# EAGLE design psu (EAGLE 6.3)
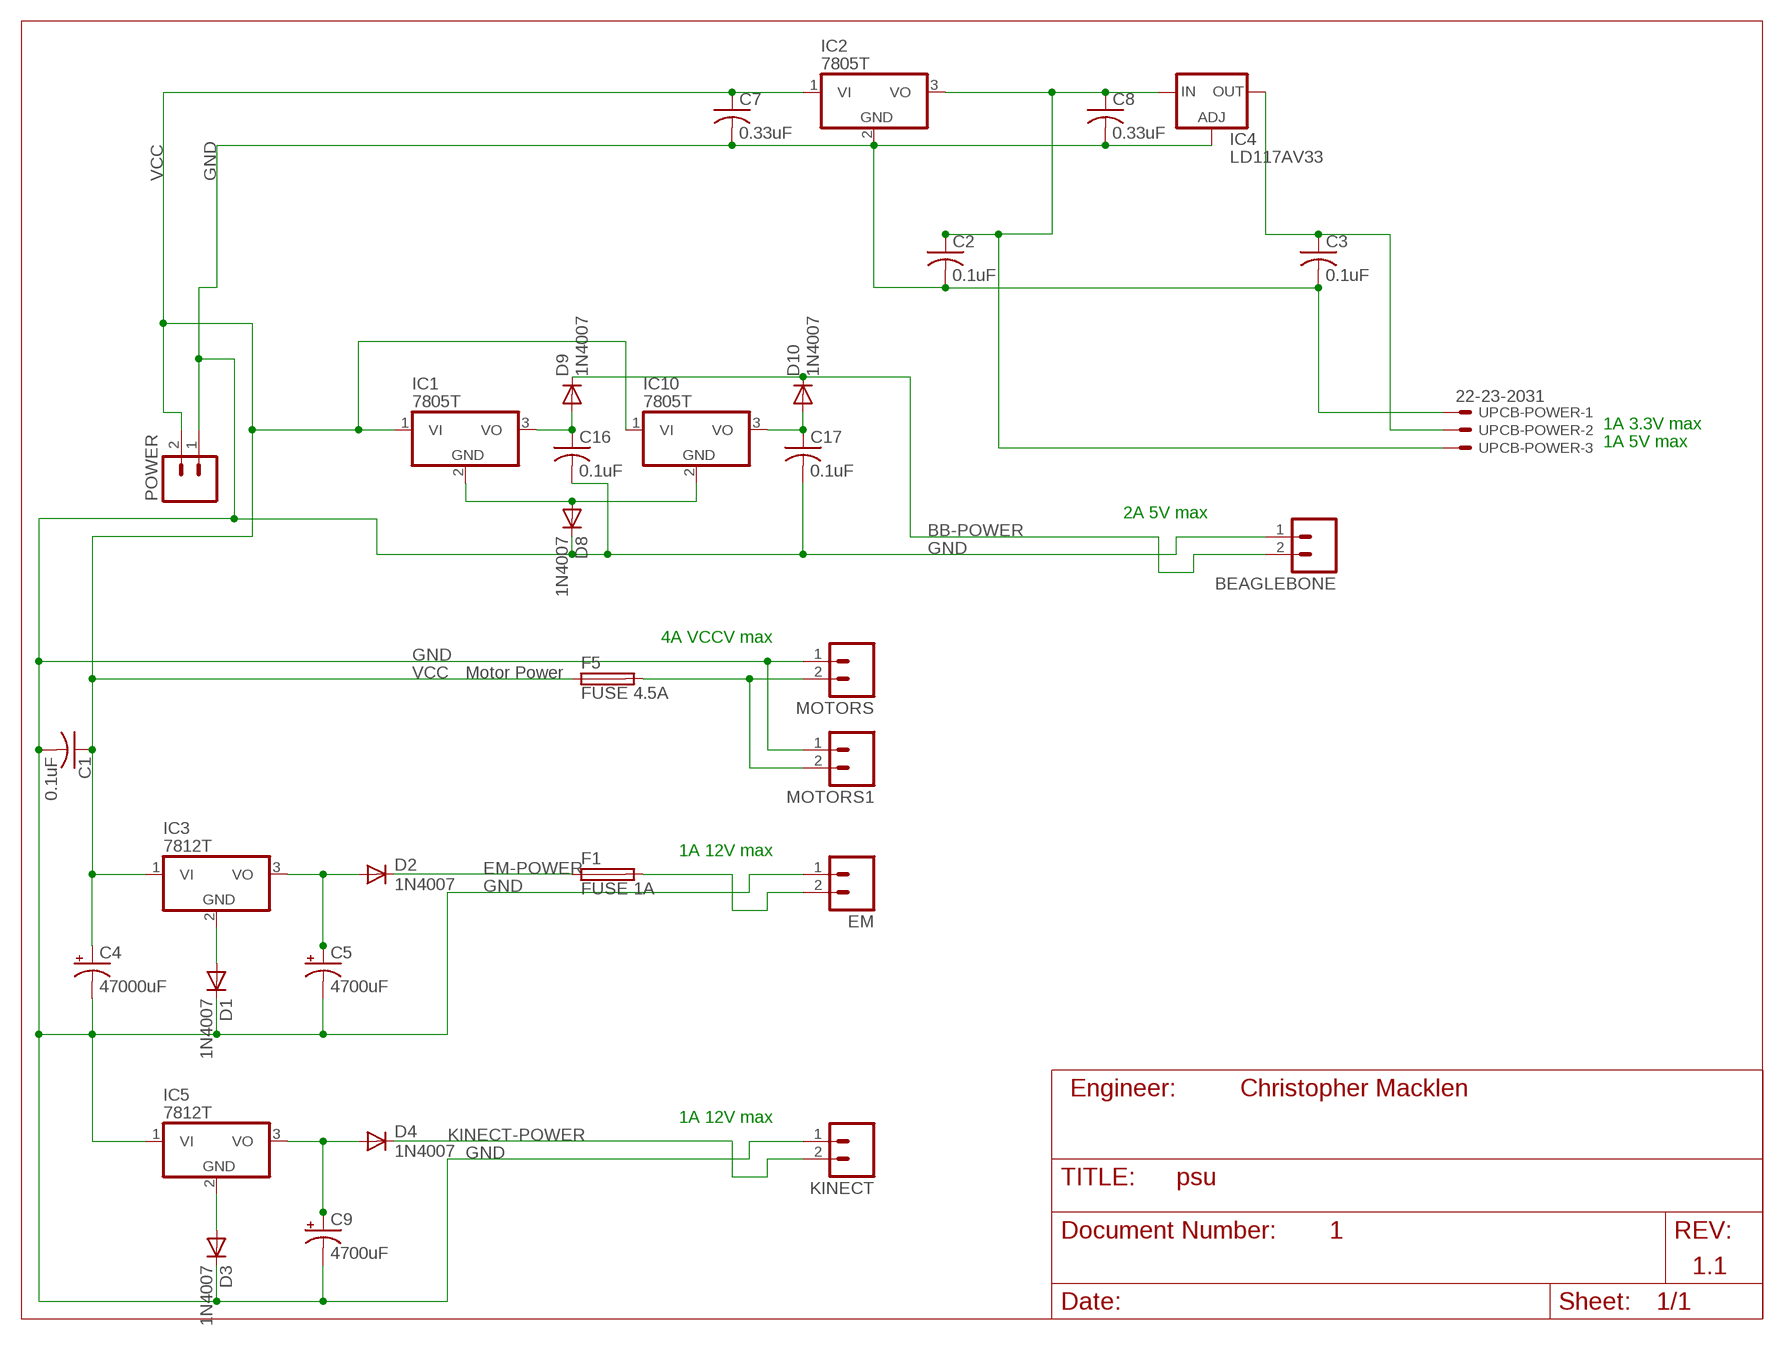
[diagram p0: schematic, sheet 1]

## Parts
BEAGLEBONE  M02  [02P]
C1  0.1uF  C-US025-025X050  [C025-025X050]
C2  0.1uF  C-US025-025X050  [C025-025X050]
C3  0.1uF  C-US025-025X050  [C025-025X050]
C4  47000uF  CPOL-USE2,5-6E  [E2,5-6E]
C5  4700uF  CPOL-USE2,5-6E  [E2,5-6E]
C7  0.33uF  C-US025-025X050  [C025-025X050]
C8  0.33uF  C-US025-025X050  [C025-025X050]
C9  4700uF  CPOL-USE2,5-6E  [E2,5-6E]
C16  0.1uF  C-US025-025X050  [C025-025X050]
C17  0.1uF  C-US025-025X050  [C025-025X050]
D1  1N4007  1N4004  [DO41-10]
D2  1N4007  1N4004  [DO41-10]
D3  1N4007  1N4004  [DO41-10]
D4  1N4007  1N4004  [DO41-10]
D8  1N4007  1N4004  [DO41-10]
D9  1N4007  1N4004  [DO41-10]
D10  1N4007  1N4004  [DO41-10]
EM  M02  [02P]
F1  FUSE 1A  FUSEPICOFUSE  [PICOFUSE]
F5  FUSE 4.5A  FUSEPICOFUSE  [PICOFUSE]
IC1  7805T  [TO220H]
IC2  7805T  [TO220H]
IC3  7812T  [TO220H]
IC4  LD117AV33  [TO220L1]
IC5  7812T  [TO220H]
IC10  7805T  [TO220H]
KINECT  M02  [02P]
MOTORS  M02  [02P]
MOTORS1  M02  [02P]
POWER  M02  [02P]
UPCB-POWER  22-23-2031  [22-23-2031]

## Nets
3.3V: C3.1 IC4.2(OUT) UPCB-POWER.2
5-1A,1: C16.1 D9.A IC1.3(VO)
5V: C2.1 C8.1 IC2.3(VO) IC4.3(IN) UPCB-POWER.3
5V-1A,2: C17.1 D10.A IC10.3(VO)
12V: C5.+ D2.A IC3.3(VO)
12V1: C9.+ D4.A IC5.3(VO)
BB-POWER: BEAGLEBONE.2 D9.C D10.C
EM-POWER: D2.C F1.1
GND: BEAGLEBONE.1 C1.2 C2.2 C3.2 C4.- C5.- C7.2 C8.2 C9.- C16.2 C17.2 D1.C D3.C D8.C EM.1 IC2.2(GND) IC4.1(ADJ) KINECT.1 MOTORS1.1 MOTORS.1 POWER.1 UPCB-POWER.1
GND-IC1: D3.A IC5.2(GND)
GND-IC1,10: D8.A IC1.2(GND) IC10.2(GND)
GND-IC3: D1.A IC3.2(GND)
KINECT-POWER: D4.C KINECT.2
N$2: F5.2 MOTORS1.2 MOTORS.2
N$3: EM.2 F1.2
VCC: C1.1 C4.+ C7.1 F5.1 IC1.1(VI) IC2.1(VI) IC3.1(VI) IC10.1(VI) POWER.2
VCC1: IC5.1(VI)

## Notes on the sheet
- 1A 3.3V max
- 1A 5V max
- 2A 5V max
- 4A VCCV max
- Motor Power
- 1A 12V max
- Engineer: | Christopher Macklen
- 1A 12V max
- 1
- 1.1

## Library data of the parts
BEAGLEBONE EM KINECT MOTORS MOTORS1 POWER = con-amp-quick:M02: AMP QUICK CONNECTOR; OC_FARNELL: unknown; OC_NEWARK: unknown
C1-C3 C7 C8 C16 C17 = rcl:C-US: CAPACITOR, American symbol
C4 C5 C9 = rcl:CPOL-US: POLARIZED CAPACITOR, American symbol
D1-D4 D8-D10 = diode:1N4004: DIODE general purpose rectifier, 1 A
F1 F5 = fuse:FUSE: Fuse; OC_FARNELL: unknown; OC_NEWARK: unknown
IC1-IC3 IC5 IC10 = linear:78*: Positive VOLTAGE REGULATOR Source: http://cache.national.com/ds/LM/LM78L05.pdf http://www.fairchildsemi.com/ds/LM/LM7805.pdf
IC4 = v-reg:LD117A?*: Low drop fixed and adjustable positive voltage regulators 1 A Source: http://www.st.com/stonline/products/literature/ds/7194/ld1117axx.pdf
UPCB-POWER = con-molex:22-23-2031: .100" (2.54mm) Center Header - 3 Pin; MF: MOLEX; MPN: 22-23-2031; OC_FARNELL: 1462950; OC_NEWARK: 30C0862

## Board
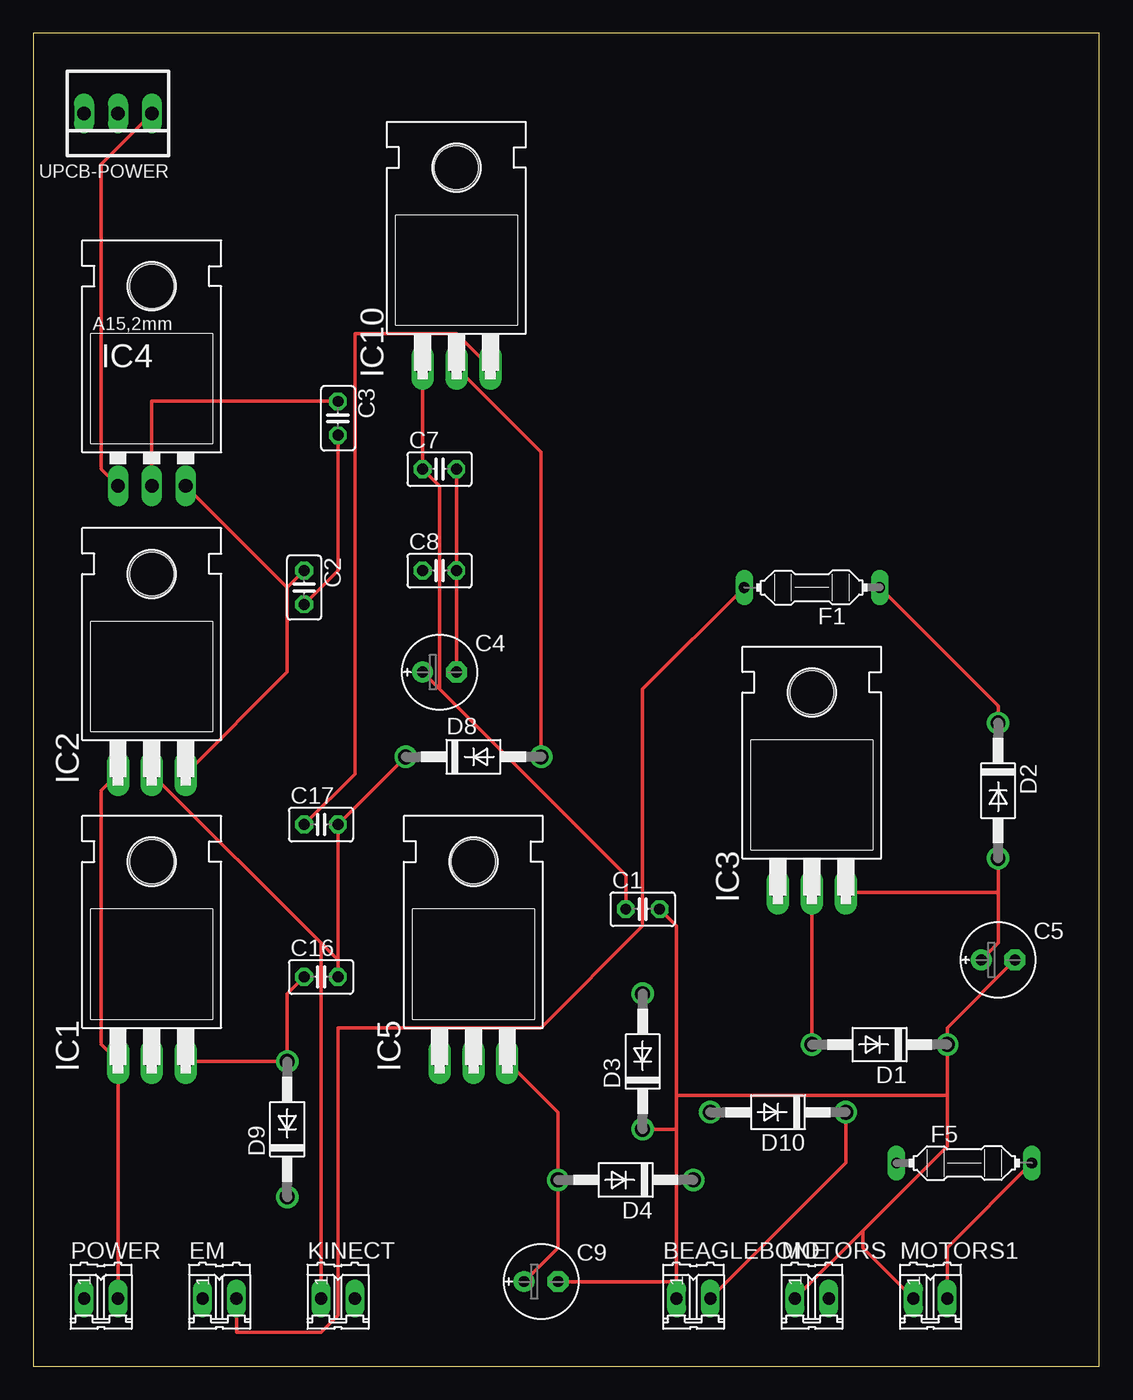
[diagram p1: board, top side]
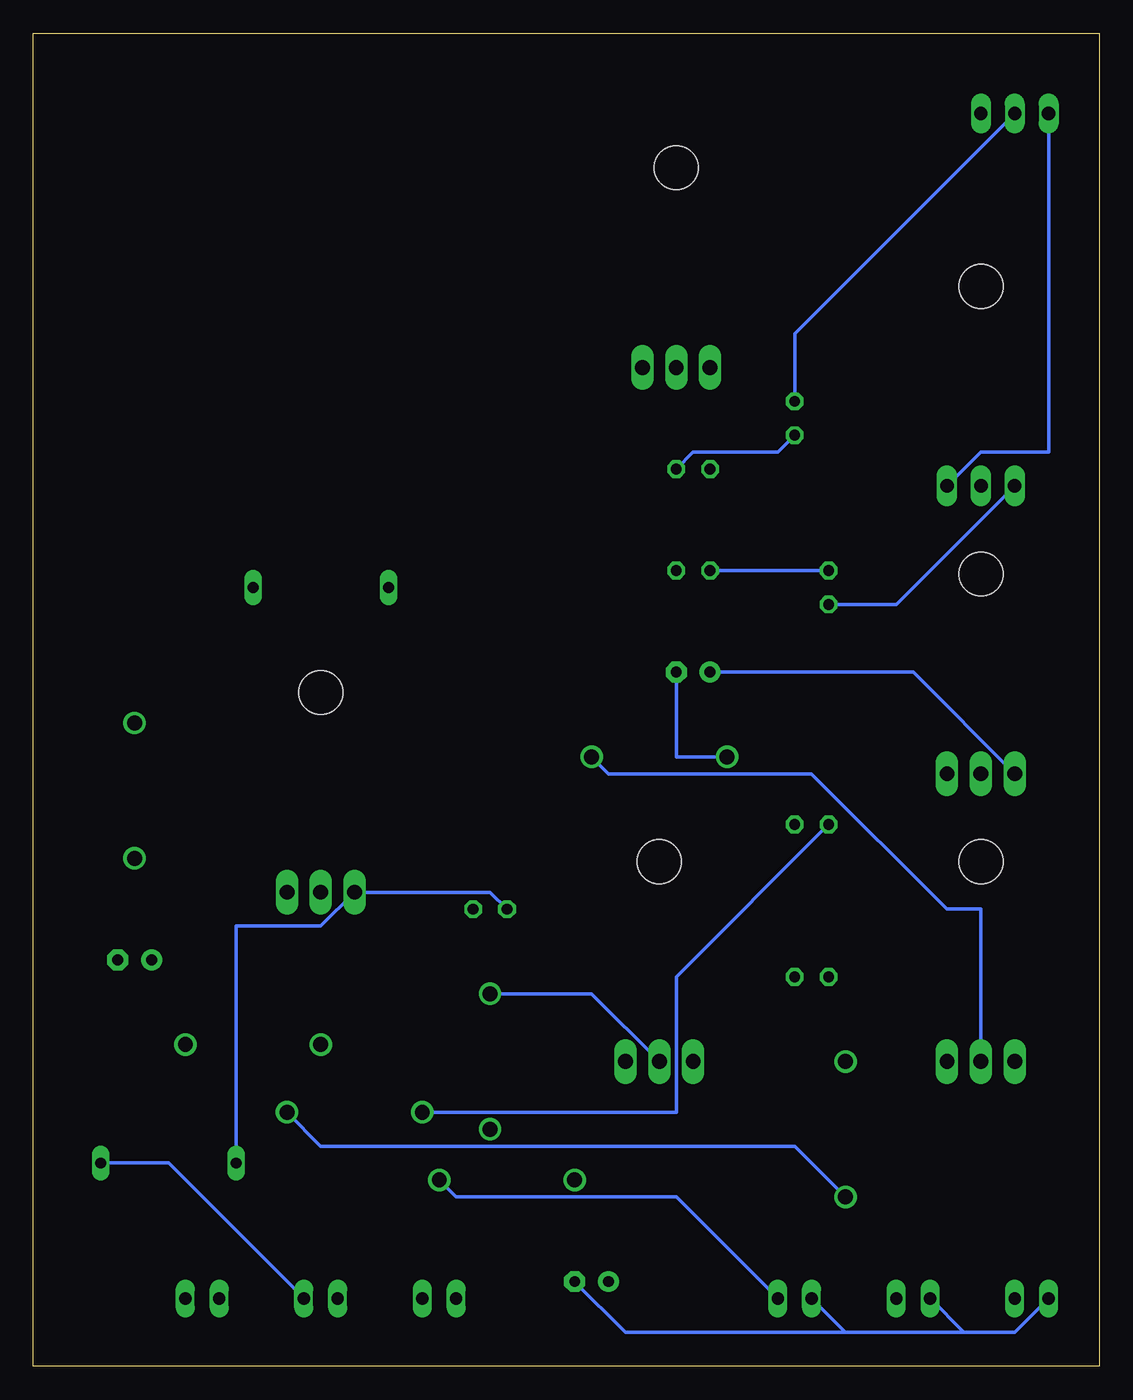
[diagram p2: board, bottom side, seen from below]

Size 79.99 x 100 mm. Coordinates in mm from the lower left corner, seen from the top.
Outline: 0,0 79.99,0 79.99,100 0,100 0,0
Copper layers (1*16): Top 0.035mm / dielectric 1.5mm / Bottom 0.035mm
Design rules "default": minimum track width 10mil, minimum drill 24mil, track to track 8mil, track to pad 8mil, pad to pad 8mil, via to via 8mil, smd to smd 8mil, copper to edge 40mil, drill to drill 8mil, minimum pad ring 10mil, minimum via ring 8mil, stop-mask expansion 4mil, vias tented up to drill 0mil, thermal gap 10mil

### Footprints (pad centres in the part's own frame; a part is rotated, then mirrored left to right if it is on the bottom)
02P = drill 0.914 long: 1 -1.27,0; 2 1.27,0
C025-025X050 = drill 0.813 octagon: 1 -1.27,0; 2 1.27,0
E2,5-6E = drill 0.813 pad 1.575: + -1.27,0 | drill 0.813 pad 1.575 octagon: - 1.27,0
DO41-10 = drill 1.118: A 5.08,0; C -5.08,0
PICOFUSE = drill 0.813 long: 1 -5.08,0; 2 5.08,0
TO220H = drill 1.118 long: 1 -2.54,-10.16; 2 0,-10.16; 3 2.54,-10.16 | hole 3.302: 0,4.826
TO220L1 = drill 1.016 long: 1 -2.54,-3.81; 2 0,-3.81; 3 2.54,-3.81 | hole 3.302: 0,11.176
22-23-2031 = drill 1 long: 1 -2.54,0; 2 0,0; 3 2.54,0

### Placement (x,y rotation side)
BEAGLEBONE  49.53,5.08 0 top
C1  45.72,34.29 0 top
C2  20.32,58.42 270 top
C3  22.86,71.12 270 top
C4  30.48,52.07 0 top
C5  72.39,30.48 0 top
C7  30.48,67.31 0 top
C8  30.48,59.69 0 top
C9  38.1,6.35 0 top
C16  21.59,29.21 0 top
C17  21.59,40.64 0 top
D1  63.5,24.13 180 top
D2  72.39,43.18 270 top
D3  45.72,22.86 90 top
D4  44.45,13.97 180 top
D8  33.02,45.72 0 top
D9  19.05,17.78 90 top
D10  55.88,19.05 180 top
EM  13.97,5.08 0 top
F1  58.42,58.42 180 top
F5  69.85,15.24 0 top
IC1  8.89,33.02 0 top
IC2  8.89,54.61 0 top
IC3  58.42,45.72 0 top
IC4  8.89,69.85 0 top
IC5  33.02,33.02 0 top
IC10  31.75,85.09 0 top
KINECT  22.86,5.08 0 top
MOTORS  58.42,5.08 0 top
MOTORS1  67.31,5.08 0 top
POWER  5.08,5.08 0 top
UPCB-POWER  6.35,93.98 180 top

### Tracks (layer width: path | path; a pad name or v marks a point on that pad's centre or on a via)
3.3V
  Top 0.254: C3.1 8.89,72.39 IC4.2
  Bottom 0.254: UPCB-POWER.2 22.86,77.47 C3.1
5-1A,1
  Top 0.254: C16.1 19.05,27.94 D9.A IC1.3
5V
  Top 0.254: IC2.3 19.05,52.07 19.05,58.42 | C2.1 19.05,58.42 | IC4.3 19.05,58.42
  Bottom 0.254: C8.1 C2.1 | UPCB-POWER.3 3.81,68.58 8.89,68.58 IC4.3
5V-1A,2
  Top 0.254: IC10.3 31.75,77.47 24.13,77.47 24.13,44.45 C17.1
  Bottom 0.254: C17.1 31.75,29.21 31.75,19.05 D10.A
12V
  Top 0.254: C5.+ 72.39,31.75 72.39,35.56 | D2.A 72.39,35.56 | 72.39,35.56 IC3.3
12V1
  Top 0.254: C9.+ 39.37,8.89 D4.A 39.37,19.05 IC5.3
BB-POWER
  Top 0.254: BEAGLEBONE.2 60.96,15.24 D10.C
  Bottom 0.254: D9.C 22.86,16.51 58.42,16.51 D10.C
EM-POWER
  Top 0.254: F1.1 72.39,49.53 D2.C
GND
  Top 0.254: C1.2 48.26,33.02 48.26,20.32 | 48.26,6.35 48.26,17.78 | 48.26,17.78 48.26,20.32 | 48.26,6.35 C9.- | 48.26,6.35 BEAGLEBONE.1 | 48.26,17.78 D3.C | 62.23,10.16 68.58,16.51 68.58,20.32 | 62.23,10.16 MOTORS.1 | 68.58,20.32 D1.C 68.58,25.4 C5.- | MOTORS1.1 62.23,8.89 62.23,10.16 | 68.58,20.32 48.26,20.32 | UPCB-POWER.1 5.08,90.17 5.08,67.31 IC4.1 | C2.2 22.86,59.69 C3.2 | C7.2 C8.2 C4.- | 22.86,30.48 C17.2 D8.C | 22.86,30.48 C16.2 | 22.86,30.48 21.59,31.75 | 21.59,31.75 IC2.2 | 21.59,31.75 KINECT.1
  Bottom 0.254: C3.2 24.13,68.58 30.48,68.58 C7.2 | POWER.1 6.35,2.54 10.16,2.54 | EM.1 10.16,2.54 | 19.05,2.54 KINECT.1 | 10.16,2.54 19.05,2.54 | C4.- 31.75,45.72 D8.C | IC4.1 15.24,57.15 C2.2 | C9.- 35.56,2.54 19.05,2.54
GND-IC1
  Bottom 0.254: IC5.2 38.1,27.94 D3.A
GND-IC1,10
  Top 0.254: IC10.2 38.1,68.58 D8.A
  Bottom 0.254: IC1.2 8.89,34.29 11.43,34.29 21.59,44.45 36.83,44.45 D8.A
GND-IC3
  Top 0.254: IC3.2 D1.A
KINECT-POWER
  Bottom 0.254: KINECT.2 31.75,12.7 48.26,12.7 D4.C
N$2
  Top 0.254: F5.2 68.58,8.89 MOTORS1.2
  Bottom 0.254: MOTORS.2 69.85,15.24 F5.2
N$3
  Top 0.254: F1.2 45.72,50.8 45.72,33.02 38.1,25.4 22.86,25.4 22.86,3.81 21.59,2.54 15.24,2.54 EM.2
VCC
  Top 0.254: POWER.2 IC1.1 5.08,24.13 5.08,43.18 IC2.1 | IC10.1 C7.1 30.48,66.04 30.48,50.8 | 30.48,50.8 44.45,36.83 C1.1 | 30.48,50.8 C4.+
  Bottom 0.254: C1.1 45.72,35.56 IC3.1 58.42,33.02 64.77,33.02 F5.1 | IC2.1 13.97,52.07 C4.+